# Altium schematic sheet Power Topology.SchDoc
size A; SheetNumber: 1; SheetTotal: 3
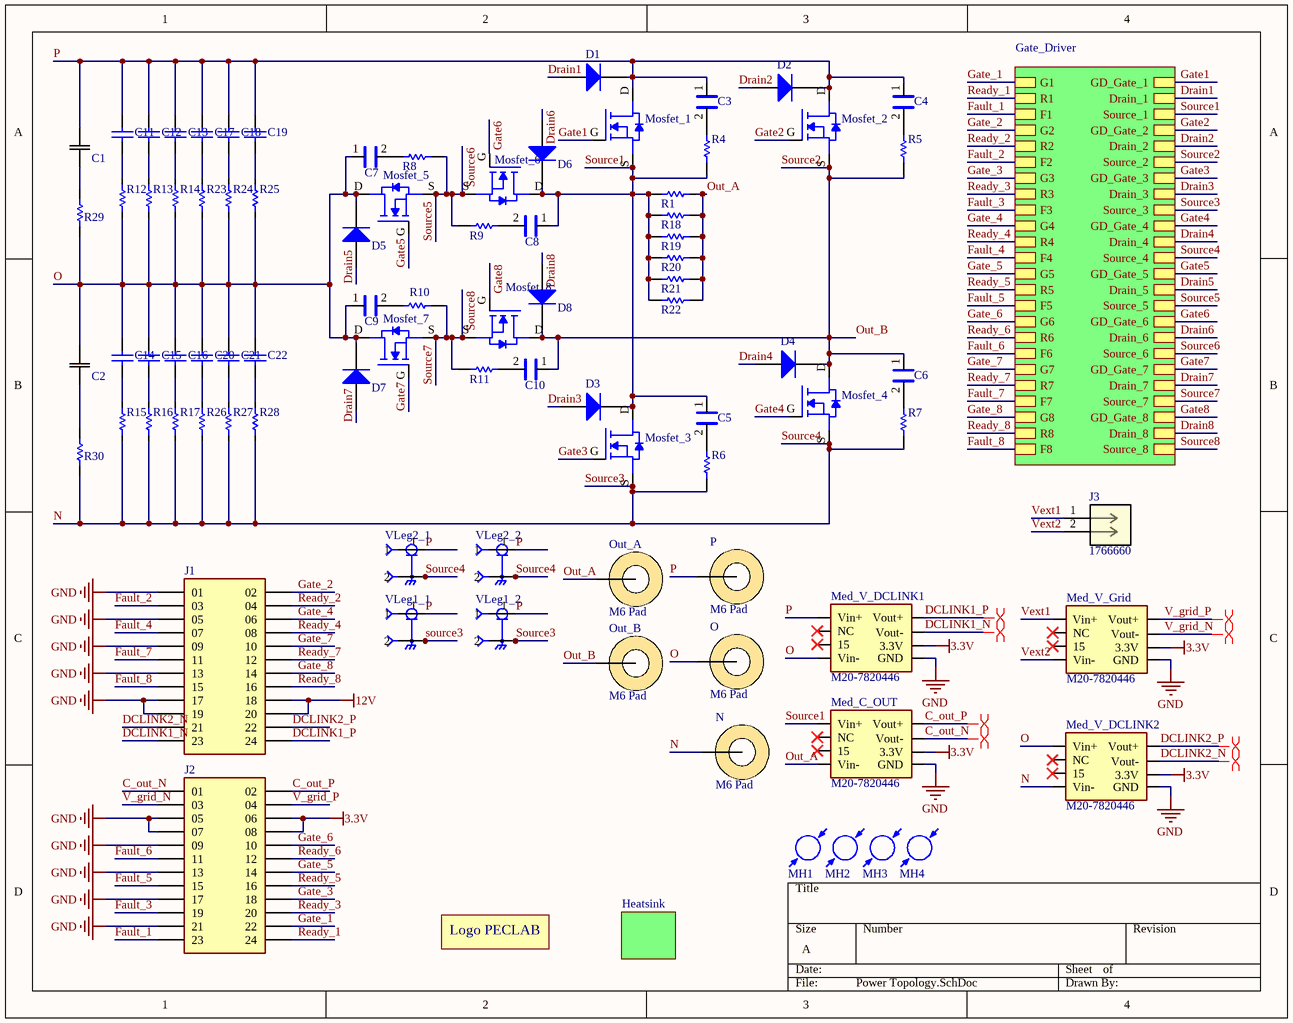
[diagram p0: Power Topology.SchDoc]

## Parts
*  LOGO PECLAB  [LOGO PECLAB 2]  (value not drawn)  (no BOM)
C1  C4AQIBU5125A12J  [CAP_C4AQ_B_2_KEM]  (value not drawn)
C2  C4AQIBU5125A12J  [CAP_C4AQ_B_2_KEM]  (value not drawn)
C3  C1808C681JGGAC7800  [CAPC4520X200N]  (value not drawn)
C4  C1808C681JGGAC7800  [CAPC4520X200N]  (value not drawn)
C5  C1808C681JGGAC7800  [CAPC4520X200N]  (value not drawn)
C6  C1808C681JGGAC7800  [CAPC4520X200N]  (value not drawn)
C7  C1808C681JGGAC7800  [CAPC4520X200N]  (value not drawn)
C8  C1808C681JGGAC7800  [CAPC4520X200N]  (value not drawn)
C9  C1808C681JGGAC7800  [CAPC4520X200N]  (value not drawn)
C10  C1808C681JGGAC7800  [CAPC4520X200N]  (value not drawn)
C11  C1812C471JDGACTU  [CAP_1812]  (value not drawn)
C12  C1812C471JDGACTU  [CAP_1812]  (value not drawn)
C13  C1812C471JDGACTU  [CAP_1812]  (value not drawn)
C14  C1812C471JDGACTU  [CAP_1812]  (value not drawn)
C15  C1812C471JDGACTU  [CAP_1812]  (value not drawn)
C16  C1812C471JDGACTU  [CAP_1812]  (value not drawn)
C17  C1812C471JDGACTU  [CAP_1812]  (value not drawn)
C18  C1812C471JDGACTU  [CAP_1812]  (value not drawn)
C19  C1812C471JDGACTU  [CAP_1812]  (value not drawn)
C20  C1812C471JDGACTU  [CAP_1812]  (value not drawn)
C21  C1812C471JDGACTU  [CAP_1812]  (value not drawn)
C22  C1812C471JDGACTU  [CAP_1812]  (value not drawn)
D1  ES1MTR  [SMA]  (value not drawn)
D2  ES1MTR  [SMA]  (value not drawn)
D3  ES1MTR  [SMA]  (value not drawn)
D4  ES1MTR  [SMA]  (value not drawn)
D5  ES1MTR  [SMA]  (value not drawn)
D6  ES1MTR  [SMA]  (value not drawn)
D7  ES1MTR  [SMA]  (value not drawn)
D8  ES1MTR  [SMA]  (value not drawn)
J1  TSW-112-08-G-D-NA  [SAMTEC_TSW-112-08-G-D-NA]  (value not drawn)
J2  TSW-112-08-G-D-NA  [SAMTEC_TSW-112-08-G-D-NA]  (value not drawn)
J3  1766660  [CONN_1766660]
Med_C_OUT  M20-7820446  [Volt_meas_board]
Med_V_DCLINK1  M20-7820446  [Volt_meas_board]
Med_V_DCLINK2  M20-7820446  [Volt_meas_board]
Med_V_Grid  M20-7820446  [Volt_meas_board]
MH1  (no value)  [MH_3.4]
MH2  (no value)  [MH_3.4]
MH3  (no value)  [MH_3.4]
MH4  (no value)  [MH_3.4]
Mosfet_1  C3M0030090K  [TO-247-3]  (value not drawn)
Mosfet_2  C3M0030090K  [TO-247-3]  (value not drawn)
Mosfet_3  C3M0030090K  [TO-247-3]  (value not drawn)
Mosfet_4  C3M0030090K  [TO-247-3]  (value not drawn)
Mosfet_5  C3M0030090K  [TO-247-3]  (value not drawn)
Mosfet_6  C3M0030090K  [TO-247-3]  (value not drawn)
Mosfet_7  C3M0030090K  [TO-247-3]  (value not drawn)
Mosfet_8  C3M0030090K  [TO-247-3]  (value not drawn)
N  M6 Pad  [M6 PAD Connector]  (no BOM)
O  M6 Pad  [M6 PAD Connector]  (no BOM)
Out_A  M6 Pad  [M6 PAD Connector]  (no BOM)
Out_B  M6 Pad  [M6 PAD Connector]  (no BOM)
P  M6 Pad  [M6 PAD Connector]  (no BOM)
R1  CRCW20104R70JNEFHP  [RESC5025X70N]  (value not drawn)
R4  CRCW20104R70JNEFHP  [RESC5025X70N]  (value not drawn)
R5  CRCW20104R70JNEFHP  [RESC5025X70N]  (value not drawn)
R6  CRCW20104R70JNEFHP  [RESC5025X70N]  (value not drawn)
R7  CRCW20104R70JNEFHP  [RESC5025X70N]  (value not drawn)
R8  CRCW20104R70JNEFHP  [RESC5025X70N]  (value not drawn)
R9  CRCW20104R70JNEFHP  [RESC5025X70N]  (value not drawn)
R10  CRCW20104R70JNEFHP  [RESC5025X70N]  (value not drawn)
R11  CRCW20104R70JNEFHP  [RESC5025X70N]  (value not drawn)
R12  RL1632R-R180-F  [R_1206]  (value not drawn)
R13  RL1632R-R180-F  [R_1206]  (value not drawn)
R14  RL1632R-R180-F  [R_1206]  (value not drawn)
R15  RL1632R-R180-F  [R_1206]  (value not drawn)
R16  RL1632R-R180-F  [R_1206]  (value not drawn)
R17  RL1632R-R180-F  [R_1206]  (value not drawn)
R18  CRCW20104R70JNEFHP  [RESC5025X70N]  (value not drawn)
R19  CRCW20104R70JNEFHP  [RESC5025X70N]  (value not drawn)
R20  CRCW20104R70JNEFHP  [RESC5025X70N]  (value not drawn)
R21  CRCW20104R70JNEFHP  [RESC5025X70N]  (value not drawn)
R22  CRCW20104R70JNEFHP  [RESC5025X70N]  (value not drawn)
R23  RL1632R-R180-F  [R_1206]  (value not drawn)
R24  RL1632R-R180-F  [R_1206]  (value not drawn)
R25  RL1632R-R180-F  [R_1206]  (value not drawn)
R26  RL1632R-R180-F  [R_1206]  (value not drawn)
R27  RL1632R-R180-F  [R_1206]  (value not drawn)
R28  RL1632R-R180-F  [R_1206]  (value not drawn)
R29  CSS2H-2512R-1L00F  [RES_1L00x_BRN]  (value not drawn)
R30  CSS2H-2512R-1L00F  [RES_1L00x_BRN]  (value not drawn)
VLeg1_1  5-1814832-1  [TE_5-1814832-1]  (value not drawn)
VLeg1_2  5-1814832-1  [TE_5-1814832-1]  (value not drawn)
VLeg2_1  5-1814832-1  [TE_5-1814832-1]  (value not drawn)
VLeg2_2  5-1814832-1  [TE_5-1814832-1]  (value not drawn)

## Sub-sheets
Gate_Drivers = Gate_Driver: G1, R1, F1, G2, R2, F2, G3, R3, F3, G4, R4, F4, G5, R5, F5, GD_Gate_1, Drain_1, Source_1, GD_Gate_2, Drain_2, Source_2, GD_Gate_3, Drain_3, Source_3, GD_Gate_4, Drain_4, Source_4, GD_Gate_5, Drain_5, Source_5, G6, R6, F6, G7, R7, F7, GD_Gate_6, Drain_6, Source_6, GD_Gate_7, Drain_7, Source_7, G8, R8, F8, GD_Gate_8, Drain_8, Source_8
Heatsink = Heatsink: no entries

## Nets
3.3V: J2.06 J2.08 Med_C_OUT.6(3.3V) Med_V_DCLINK1.6(3.3V) Med_V_DCLINK2.6(3.3V) Med_V_Grid.6(3.3V)
12V: J1.18 J1.20
GND: J1.01 J1.05 J1.09 J1.13 J1.17 J1.19 J2.05 J2.07 J2.09 J2.13 J2.17 J2.21 Med_C_OUT.7(GND) Med_V_DCLINK1.7(GND) Med_V_DCLINK2.7(GND) Med_V_Grid.7(GND)
C_out_N: J2.01 Med_C_OUT.5(Vout-)
C_out_P: J2.02 Med_C_OUT.4(Vout+)
DCLINK1_N: J1.23 Med_V_DCLINK1.5(Vout-)
DCLINK1_P: J1.24 Med_V_DCLINK1.4(Vout+)
DCLINK2_N: J1.21 Med_V_DCLINK2.5(Vout-)
DCLINK2_P: J1.22 Med_V_DCLINK2.4(Vout+)
Drain1: D1.A ; sheet Gate_Drivers/Drain_1
Drain2: D2.A ; sheet Gate_Drivers/Drain_2
Drain3: D3.A ; sheet Gate_Drivers/Drain_3
Drain4: D4.A ; sheet Gate_Drivers/Drain_4
Drain5: D5.A ; sheet Gate_Drivers/Drain_5
Drain6: D6.A ; sheet Gate_Drivers/Drain_6
Drain7: D7.A ; sheet Gate_Drivers/Drain_7
Drain8: D8.A ; sheet Gate_Drivers/Drain_8
Fault_1: J2.23 ; sheet Gate_Drivers/F1
Fault_2: J1.03 ; sheet Gate_Drivers/F2
Fault_3: J2.19 ; sheet Gate_Drivers/F3
Fault_4: J1.07 ; sheet Gate_Drivers/F4
Fault_5: J2.15 ; sheet Gate_Drivers/F5
Fault_6: J2.11 ; sheet Gate_Drivers/F6
Fault_7: J1.11 ; sheet Gate_Drivers/F7
Fault_8: J1.15 ; sheet Gate_Drivers/F8
Gate1: Mosfet_1.G ; sheet Gate_Drivers/GD_Gate_1
Gate2: Mosfet_2.G ; sheet Gate_Drivers/GD_Gate_2
Gate3: Mosfet_3.G ; sheet Gate_Drivers/GD_Gate_3
Gate4: Mosfet_4.G ; sheet Gate_Drivers/GD_Gate_4
Gate5: Mosfet_5.G ; sheet Gate_Drivers/GD_Gate_5
Gate6: Mosfet_6.G ; sheet Gate_Drivers/GD_Gate_6
Gate7: Mosfet_7.G ; sheet Gate_Drivers/GD_Gate_7
Gate8: Mosfet_8.G ; sheet Gate_Drivers/GD_Gate_8
Gate_1: J2.22 ; sheet Gate_Drivers/G1
Gate_2: J1.02 ; sheet Gate_Drivers/G2
Gate_3: J2.18 ; sheet Gate_Drivers/G3
Gate_4: J1.06 ; sheet Gate_Drivers/G4
Gate_5: J2.14 ; sheet Gate_Drivers/G5
Gate_6: J2.10 ; sheet Gate_Drivers/G6
Gate_7: J1.10 ; sheet Gate_Drivers/G7
Gate_8: J1.14 ; sheet Gate_Drivers/G8
N: Med_V_DCLINK2.3(Vin-) Mosfet_3.S Mosfet_4.S N.1 R6.2 R7.2 R15.1 R16.1 R17.1 R26.1 R27.1 R28.1 R30.2 VLeg1_1.2 VLeg1_1.3 VLeg1_1.4 VLeg1_1.5 VLeg1_2.2 VLeg1_2.3 VLeg1_2.4 VLeg1_2.5 VLeg2_1.2 VLeg2_1.3 VLeg2_1.4 VLeg2_1.5 VLeg2_2.2 VLeg2_2.3 VLeg2_2.4 VLeg2_2.5 ; sheet Gate_Drivers/Source_3, sheet Gate_Drivers/Source_4  [also labelled Source3, Source4]
O: C2.2 C7.1 C9.1 C14.1 C15.1 C16.1 C20.1 C21.1 C22.1 D5.K D7.K Med_V_DCLINK1.3(Vin-) Med_V_DCLINK2.0(Vin+) Mosfet_5.D Mosfet_7.D O.1 R12.1 R13.1 R14.1 R23.1 R24.1 R25.1 R29.2
Out_A: Med_C_OUT.3(Vin-) Out_A.1 R1.1 R18.1 R19.1 R20.1 R21.1 R22.1
Out_B: C6.1 C10.1 D4.K D8.K Mosfet_2.S Mosfet_4.D Mosfet_8.D Out_B.1 R5.2 ; sheet Gate_Drivers/Source_2  [also labelled Source2]
P: C1.2 C3.1 C4.1 C11.1 C12.1 C13.1 C17.1 C18.1 C19.1 D1.K D2.K Med_V_DCLINK1.0(Vin+) Mosfet_1.D Mosfet_2.D P.1 VLeg1_1.1 VLeg1_2.1 VLeg2_1.1 VLeg2_2.1
Ready_1: J2.24 ; sheet Gate_Drivers/R1
Ready_2: J1.04 ; sheet Gate_Drivers/R2
Ready_3: J2.20 ; sheet Gate_Drivers/R3
Ready_4: J1.08 ; sheet Gate_Drivers/R4
Ready_5: J2.16 ; sheet Gate_Drivers/R5
Ready_6: J2.12 ; sheet Gate_Drivers/R6
Ready_7: J1.12 ; sheet Gate_Drivers/R7
Ready_8: J1.16 ; sheet Gate_Drivers/R8
Source1: C5.1 C8.1 D3.K D6.K Med_C_OUT.0(Vin+) Mosfet_1.S Mosfet_3.D Mosfet_6.D R1.2 R4.2 R18.2 R19.2 R20.2 R21.2 R22.2 ; sheet Gate_Drivers/Source_1
Source5: Mosfet_5.S Mosfet_6.S R8.2 R9.2 ; sheet Gate_Drivers/Source_5, sheet Gate_Drivers/Source_6  [also labelled Source6]
Source7: Mosfet_7.S Mosfet_8.S R10.2 R11.2 ; sheet Gate_Drivers/Source_7, sheet Gate_Drivers/Source_8  [also labelled Source8]
V_grid_N: J2.03 Med_V_Grid.5(Vout-)
V_grid_P: J2.04 Med_V_Grid.4(Vout+)
Vext1: J3.1 Med_V_Grid.0(Vin+)
Vext2: J3.2 Med_V_Grid.3(Vin-)
NetC1_1: C1.1 R29.1
NetC2_1: C2.1 R30.1
NetC3_2: C3.2 R4.1
NetC4_2: C4.2 R5.1
NetC5_2: C5.2 R6.1
NetC6_2: C6.2 R7.1
NetC7_2: C7.2 R8.1
NetC8_2: C8.2 R9.1
NetC9_2: C9.2 R10.1
NetC10_2: C10.2 R11.1
NetC11_2: C11.2 R12.2
NetC12_2: C12.2 R13.2
NetC13_2: C13.2 R14.2
NetC14_2: C14.2 R15.2
NetC15_2: C15.2 R16.2
NetC16_2: C16.2 R17.2
NetC17_2: C17.2 R23.2
NetC18_2: C18.2 R24.2
NetC19_2: C19.2 R25.2
NetC20_2: C20.2 R26.2
NetC21_2: C21.2 R27.2
NetC22_2: C22.2 R28.2

Not connected (* = marked no-connect by the designer): Med_C_OUT 1(NC)* 2(15)*; Med_V_DCLINK1 1(NC)* 2(15)*; Med_V_DCLINK2 1(NC)* 2(15)*; Med_V_Grid 1(NC)* 2(15)*

## Layout directives
differential pair: C_out_N, C_out_P, DCLINK1_N, DCLINK1_P, DCLINK2_N, DCLINK2_P, V_grid_N, V_grid_P

## Notes on the sheet
- (in symbol LOGO PECLAB) Logo PECLAB

## Library data of the parts
C1 C2 = Cap Film 12.5 uF: 12.5 µF Film Capacitor 800V Polypropylene (PP), Metallized Radial; Mfr_Name: Kemet
C3-C10 = CAP CER 680PF 1808: CAP CER 680PF 2KV C0G/NP0 1808; MF: KEMET; Package: 1808 (4520 Metric); Price: None; Value: 680 pF; MP: C1808C681JGGAC7800; Availability: Unavailable
C11-C22 = C1812C471JDGACTU: Cap Ceramic 470pF 1000V C0G 5% SMD 1812 125°C Embossed Plastic T/R; Manufacturer: KEMET; Voltage Rating: 1kV; Supplier 1: Newark; Manufacturer Part Number: C1812C471JDGACTU; RoHS: Yes; Category: Ceramic Capacitors; Stock 1: 614; Pricing 1: 1=1,23000, 10=1,18000, 25=1,17000, 50=1,16000, 100=1,16000 (USD); Mount: Surface Mount; Case/Package: 1812; Dielectric Material: Ceramic; Min Operating Temperature: -55°C; Max Operating Temperature: 125°C; Capacitance: 470pF; Dielectric: C0G; Packaging: Tape and Reel; Tolerance: 5%; Voltage Rating (DC): 1kV; Length: 0.177inch; Width: 0.126inch; Thickness: 0.071inch; Lead Free: Lead Free; Supplier Part Number 1: 05AC8285
D1-D8 = Diode_1: Diode Standard 1000 V 1A Surface Mount SMA; MF: SMC Diode Solutions; MFP: ES1MTR; Created: 2021_05_16_EDuran; Package: SMA; Value: ES1MTR; Supplier 1: Digi-Key; Supplier Part Number 1: 1655-1736-1-ND
J1 J2 = TSW-112-08-G-D-NA: Conn Unshrouded Header HDR 24 POS 2.54mm Solder RA Side Entry Thru-Hole Bulk; MF: Samtec; Package: None; Price: None; Check_prices: https://www.snapeda.com/parts/TSW-112-08-G-D-NA/Samtec/view-part/?ref=eda; Value: *; SnapEDA_Link: https://www.snapeda.com/parts/TSW-112-08-G-D-NA/Samtec/view-part/?ref=snap; MP: TSW-112-08-G-D-NA; Availability: In Stock; Purchase-URL: https://pricing.snapeda.com/search/part/TSW-112-08-G-D-NA/?ref=eda
J3 = 1766660: No Description Available; Mfr_Name: Phoenix Contact; RefDes: RefDes; Type: Type
Med_C_OUT Med_V_DCLINK1 Med_V_DCLINK2 Med_V_Grid = Volt_meas_board: Tarjeta de medicion de voltaje con conector receptor 4 pos 2.54mm; pin to pad: 0>1 1>2 2>3 3>4 4>5 5>6 6>7 7>8; MF: Harwin Inc; MP: M20-7820446; Value: 2.54mm; Package: 4 pos
MH1-MH4 = Mounting Hole: Non plated through hole
Mosfet_1-Mosfet_8 = MOSFET_TO247-3: MOSFET N-CH 60V 195A TO247; MF: Cree/Wolfspeed; MFP: C3M0030090K; Created: 2020_07_07_DArancibia; Package: TO-247-4; Value: C3M0030090K; Supplier 1: Digi-Key; Supplier Part Number 1: 1697-C3M0030090K-ND
N O Out_A Out_B P = Con_Pad_M6: Pad M6; Created: 2021_07_09_DArancibia; Value: M6 Pad
R1 R4-R11 R18-R22 = Res 2010 4.7 Ohms: 4.7 Ohms ±5% 1W Chip Resistor 2010 (5025 Metric) Automotive AEC-Q200, Pulse Withstanding Thick Film; MF: Vishay Dale; Package: 2010 (5025 Metric); Price: None; Value: 4.7 Ohms; MP: CRCW20104R70JNEFHP; Availability: Unavailable
R12-R17 R23-R28 = RL1632R-R180-F: Res Thin Film 1206 0.18 Ohm 1% 0.5W(1/2W) 0ppm/C to 100ppm/C Molded SMD Automotive T/R; Manufacturer: Susumu; Resistance: 180mR; Power Rating: 500mW; Temperature Coefficient: 100ppm/°C; Supplier 1: Digi-Key; Manufacturer Part Number: RL1632R-R180-F; RoHS: No; Category: Chip SMD Resistors; Stock 1: 112939; Pricing 1: 1=0,59000, 10=0,42400, 25=0,33080, 50=0,28000, 100=0,22060, 250=0,18664, 500=0,15272, 1000=0,11878 (USD); Case/Package: 1206; Number of Pins: 2; Case Code (Metric): 3216; Case Code (Imperial): 1206; Weight: 0.000571oz; Size Code: 1206; Min Operating Temperature: -55°C; Max Operating Temperature: 125°C; Tolerance: 1%; Package Quantity: 1; Packaging: Cut Tape; Resistor Type: Thin Film; Number of Terminations: 2; Termination: SMD/SMT; Max Power Dissipation: 500mW; Series: RL; Technology: THIN FILM; Resistance Tolerance: 1%; Length: 0.126inch; Width: 0.063inch; Height: 0.026inch; REACH SVHC: Unknown; Lead Free: Lead Free; ComponentLink1URL: https://datasheet.ciiva.com/12913/e-15-16-12913646.pdf?src-supplier=Mouser; ComponentLink1Description: https://datasheet.ciiva.com/12913/e-15-16-12913646.pdf?src-supplier=Mouser; ComponentLink2URL: https://datasheet.ciiva.com/2490/rl-data-sheet-2490371.pdf?src-supplier=Digi-Key; ComponentLink2Description: https://datasheet.ciiva.com/2490/rl-data-sheet-2490371.pdf?src-supplier=Digi-Key; ComponentLink3URL: https://datasheet.ciiva.com/2490/rl-data-sheet-2490370.pdf?src-supplier=Digi-Key; ComponentLink3Description: https://datasheet.ciiva.com/2490/rl-data-sheet-2490370.pdf?src-supplier=Digi-Key; ComponentLink4URL: https://datasheet.ciiva.com/2490/rl-data-sheet-2490372.pdf?src-supplier=Digi-Key; ComponentLink4Description: https://datasheet.ciiva.com/2490/rl-data-sheet-2490372.pdf?src-supplier=Digi-Key; Supplier Part Number 1: RL16R.18FCT-ND
R29 R30 = RES_2512: 1 mOhms ±1% 5W Chip Resistor 2512 (6432 Metric) Automotive AEC-Q200, Current Sense Metal Element; Mfr_Name: Bourns Electronics
VLeg1_1 VLeg1_2 VLeg2_1 VLeg2_2 = 5-1814832-1: SMA Str PCB Skt GZD; Value: *; MP: 5-1814832-1; Package: None; Availability: Unavailable; Price: None